# Altium schematic sheet Micro_USB.SchDoc
size A; SheetNumber: 4; SheetTotal: 5
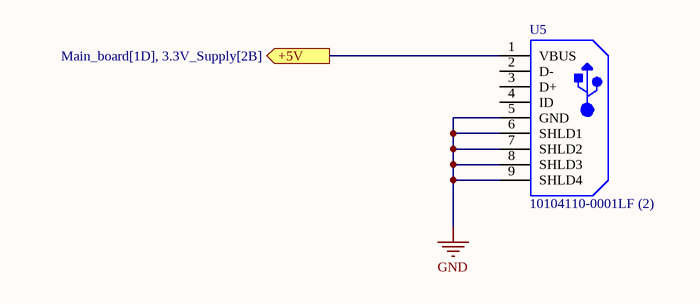
[diagram p0: Micro_USB.SchDoc]

## Parts
U5  10104110-0001LF (2)  [FCI-10104110-0001LF_V]

## Ports
+5V (out, see Main_board[1D], 3.3V_Supply[2B])

## Nets
GND: U5.5(GND) U5.6(SHLD1) U5.7(SHLD2) U5.8(SHLD3) U5.9(SHLD4)
+5V: U5.1(VBUS) ; port +5V

Not connected (* = marked no-connect by the designer): U5 2(D-) 3(D+) 4(ID)

## Library data of the parts
U5 = 10104110-0001LF (2): Usb Connector, 5 Contact(S), Female, Right Angle, Surface Mount Terminal, Locking, Receptacle; Manufacturer: Amphenol Communications Solutions; Connector Type: Receptacle, USB; Contact Resistance: 10mΩ; Current Rating: 1.8A; Insulation Resistance: 100MΩ; Max Voltage Rating (AC): 100V; Number of Contacts: 5; Number of Ports: 1; Pitch: 650µm; Plating Thickness: 762nm; USB Standard: USB 2.0; Supplier: DigiKey; Supplier Part Number: 609-4052-1-ND; Manufacturer Part Number: 10104110-0001LF; RoHS: Compliant; Category: USB Connectors; Stock: 9186; Pricing: 1=0.81, 10=0.687, 25=0.6436, 50=0.613, 100=0.5836, 250=0.547, 500=0.52088 (USD); China RoHS: Compliant; Contact Gender: Female; Contact Material: Gold, Nickel; Contact Plating: Gold; Depth: 5.6mm; Gender: Receptacle; Height: 2.99mm; Housing Material: Thermoplastic; Lead Free: Lead Free; Length: 8.06mm; Lifecycle Status: Production; Max Operating Temperature: 80°C; Min Operating Temperature: -55°C; Mounting Technology: Horizontal, Surface Mount; Pins: 5; Number of Positions: 5; Number of Rows: 1; Number of Terminals: 5; Orientation: Right Angle; Radiation Hardening: No; REACH SVHC: Yes; Shell Finish: Tin; Shell Material: Stainless Steel; Terminal Pitch: 660.4µm; Termination: Solder; Voltage Rating: 100V; ComponentLink1URL: https://datasheet.octopart.com:443/10104110-0001LF-Amphenol-Communications-Solutions-datasheet-96019471.pdf?src-supplier=element14+APAC; ComponentLink1Description: https://datasheet.octopart.com:443/10104110-0001LF-Amphenol-Communications-Solutions-datasheet-96019471.pdf?src-supplier=element14+APAC; ComponentLink2URL: https://datasheet.octopart.com:443/10104110-0001LF-Amphenol-Communications-Solutions-datasheet-11971448.pdf?src-supplier=IHS; ComponentLink2Description: https://datasheet.octopart.com:443/10104110-0001LF-Amphenol-Communications-Solutions-datasheet-11971448.pdf?src-supplier=IHS; ComponentLink3URL: https://datasheet.octopart.com:443/10104110-0001LF-Amphenol-Communications-Solutions-datasheet-13707371.pdf?src-supplier=Electro+Sonic; ComponentLink3Description: https://datasheet.octopart.com:443/10104110-0001LF-Amphenol-Communications-Solutions-datasheet-13707371.pdf?src-supplier=Electro+Sonic; ComponentLink4URL: https://datasheet.octopart.com:443/10104110-0001LF-Amphenol-Communications-Solutions-datasheet-13702204.pdf?src-supplier=RS+(Formerly+Allied+Electronics); ComponentLink4Description: https://datasheet.octopart.com:443/10104110-0001LF-Amphenol-Communications-Solutions-datasheet-13702204.pdf?src-supplier=RS+(Formerly+Allied+Electronics)